# EAGLE design psvemmc-v12 (EAGLE 8.4.3)
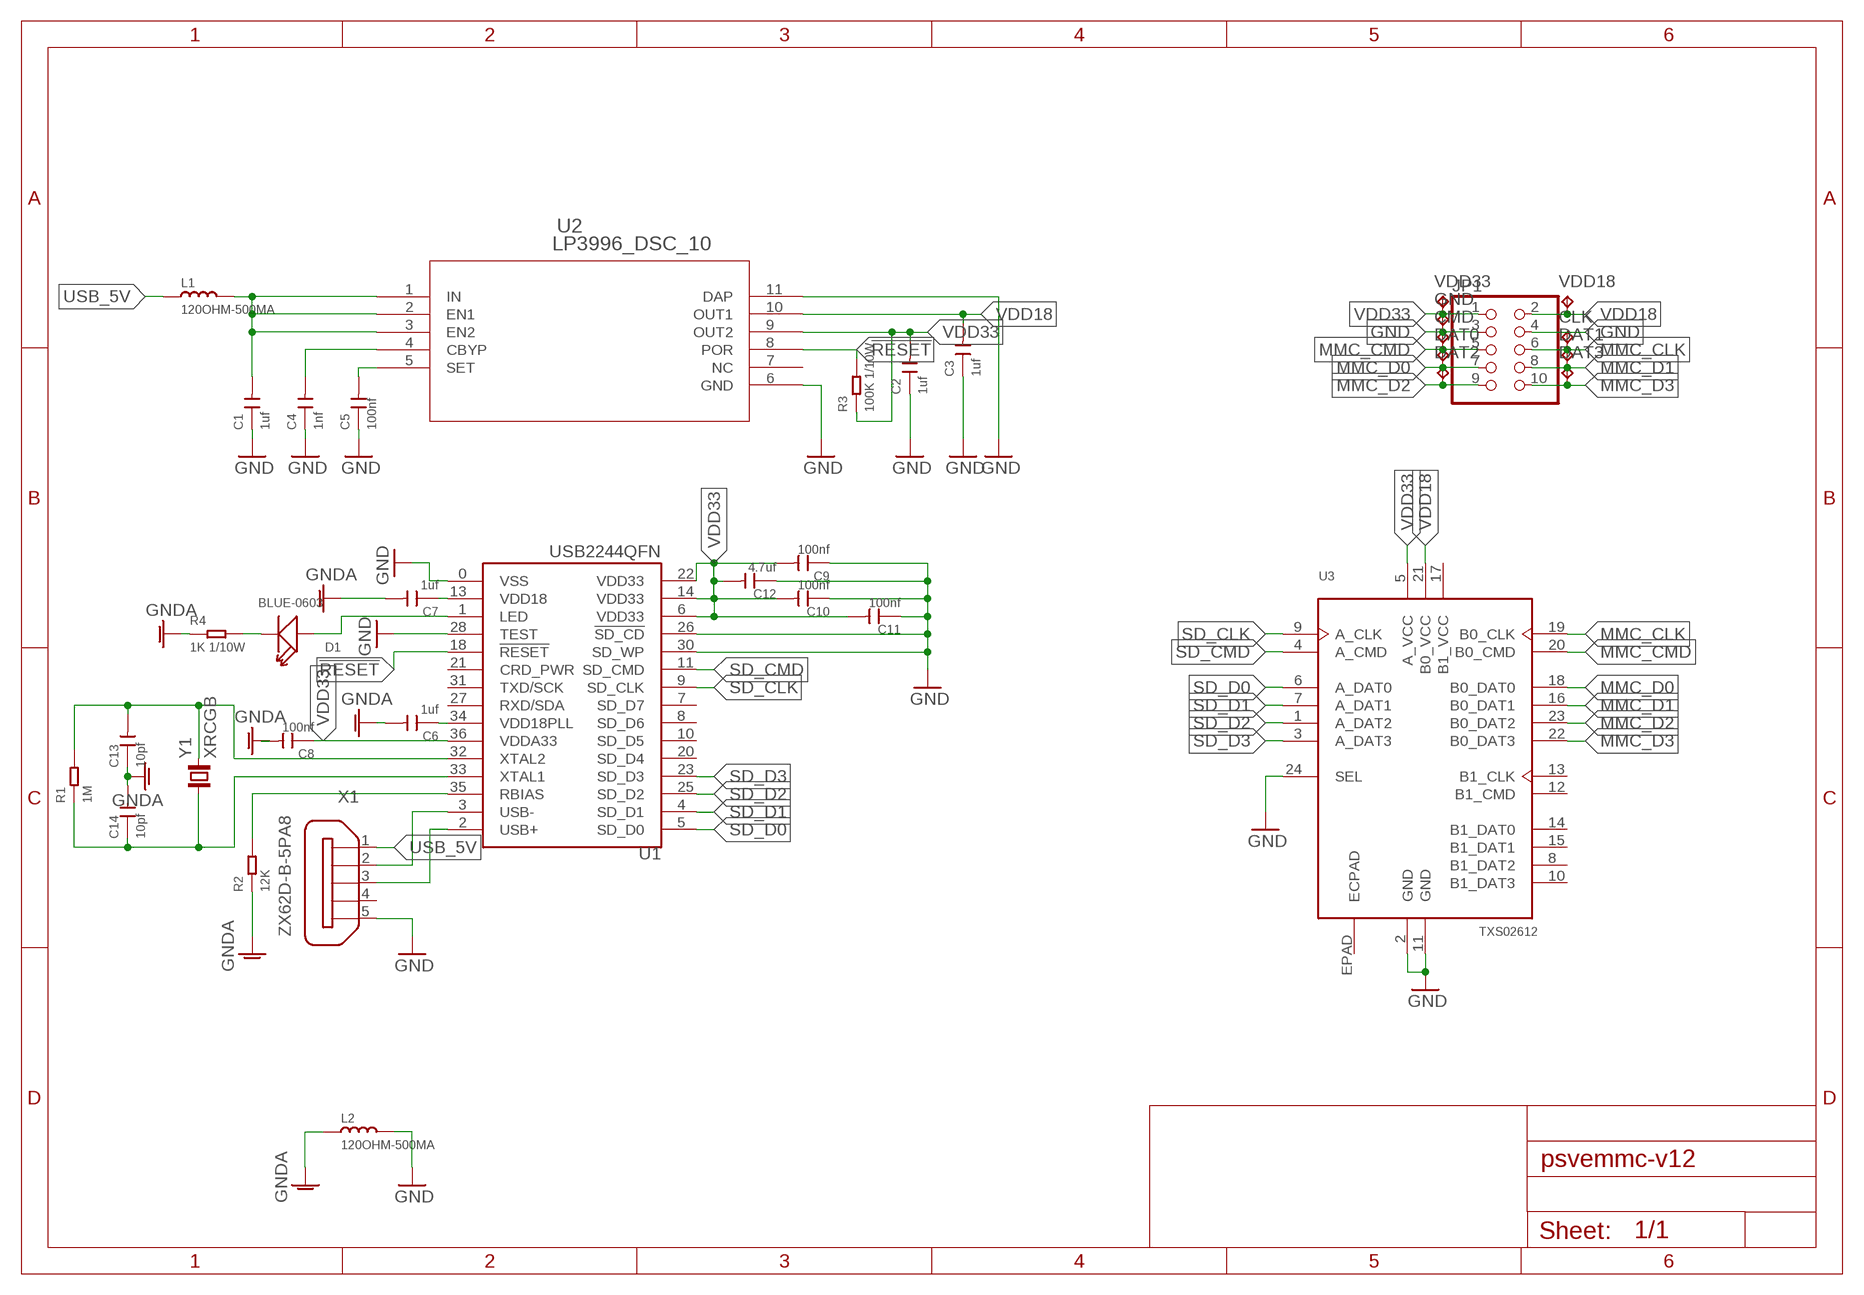
[diagram p0: schematic, sheet 1]

## Parts
C1  1uf  CERAMIC-1UF-25V-10%-X7R(0603)  [C0603]
C2  1uf  CERAMIC-1UF-25V-10%-X7R(0603)  [C0603]
C3  1uf  CERAMIC-1UF-25V-10%-X7R(0603)  [C0603]
C4  1nf  CERAMIC-1NF-50V-5%-C0G(0603)  [C0603]
C5  100nf  CERAMIC-100NF-50V-10%-X7R(0603)  [C0603]
C6  1uf  CERAMIC-1UF-25V-10%-X7R(0603)  [C0603]
C7  1uf  CERAMIC-1UF-25V-10%-X7R(0603)  [C0603]
C8  100nf  CERAMIC-100NF-50V-10%-X7R(0603)  [C0603]
C9  100nf  CERAMIC-100NF-50V-10%-X7R(0603)  [C0603]
C10  100nf  CERAMIC-100NF-50V-10%-X7R(0603)  [C0603]
C11  100nf  CERAMIC-100NF-50V-10%-X7R(0603)  [C0603]
C12  4.7uf  CERAMIC-4.7UF-10V-10%-X5R(0603)  [C0603]
C13  10pf  CERAMIC-10PF-50V-5%-NPO(0603)  [C0603]
C14  10pf  CERAMIC-10PF-50V-5%-NPO(0603)  [C0603]
CLK  TPTP20SQ  [TP20SQ]
CMD  TPTP20SQ  [TP20SQ]
D1  BLUE-0603  SMD-LED-CLEAR-BLUE(0603)  [LED-0603]
DAT0  TPTP20SQ  [TP20SQ]
DAT1  TPTP20SQ  [TP20SQ]
DAT2  TPTP20SQ  [TP20SQ]
DAT3  TPTP20SQ  [TP20SQ]
GND  TPTP20SQ  [TP20SQ]
JP1  PINHD-2X5  [2X05]
L1  120OHM-500MA  SMD-FERRITE-CHIP-120-OHM-500MA(0603)  [L0603]
L2  120OHM-500MA  SMD-FERRITE-CHIP-120-OHM-500MA(0603)  [L0603]
R1  1M  SMD-RES-1M-1%-1/10W(0603)  [R0603]
R2  12K  SMD-RES-12K-1%-1/10W(0603)  [R0603]
R3  100K 1/10W  SMD-RES-100K-5%-1/10W(0603)  [R0603]
R4  1K 1/10W  SMD-RES-1K-5%-1/10W(0603)  [R0603]
U1  USB2244QFN  [QFN36]
U2  LP3996_DSC_10  [SDA10A]
U3  TXS02612  [S-PWQFN-N24]
VDD18  TPTP20SQ  [TP20SQ]
VDD33  TPTP20SQ  [TP20SQ]
X1  ZX62D-B-5PA8  [ZX62D-B-5PA8]
Y1  XRCGB  [XRCGB]

## Nets
!RESET: R3.2 U1.18(!RESET) U2.8(POR)
GND [GND]: C1.1 C2.1 C3.1 C4.1 C5.1 C9.1 C10.1 C11.1 C12.1 GND.TP JP1.3 JP1.4 L2.2 U1.0(VSS) U1.26(!SD_CD) U1.28(TEST) U1.30(SD_WP) U2.6(GND) U2.11(DAP) U3.2(GND) U3.11(GND) U3.24(SEL) X1.5
GNDA: C6.2 C7.2 C8.2 C13.1 C14.2 L2.1 R2.1 R4.1
LED: D1.+ U1.1(LED)
LED_M: D1.- R4.2
MMC_CLK: CLK.TP JP1.6 U3.19(B0_CLK)
MMC_CMD: CMD.TP JP1.5 U3.20(B0_CMD)
MMC_D0: DAT0.TP JP1.7 U3.18(B0_DAT0)
MMC_D1: DAT1.TP JP1.8 U3.16(B0_DAT1)
MMC_D2: DAT2.TP JP1.9 U3.23(B0_DAT2)
MMC_D3: DAT3.TP JP1.10 U3.22(B0_DAT3)
N$2: C4.2 U2.4(CBYP)
RBIAS: R2.2 U1.35(RBIAS)
SD_CLK: U1.9(SD_CLK) U3.9(A_CLK)
SD_CMD: U1.11(SD_CMD) U3.4(A_CMD)
SD_D0: U1.5(SD_D0) U3.6(A_DAT0)
SD_D1: U1.4(SD_D1) U3.7(A_DAT1)
SD_D2: U1.25(SD_D2) U3.1(A_DAT2)
SD_D3: U1.23(SD_D3) U3.3(A_DAT3)
SET: C5.2 U2.5(SET)
USB_5V: L1.1 X1.1
USB_M [USB]: U1.3(USB-) X1.2
USB_P [USB]: U1.2(USB+) X1.3
VDD5: C1.2 L1.2 U2.1(IN) U2.2(EN1) U2.3(EN2)
VDD18: C3.2 JP1.2 U2.10(OUT1) U3.21(B0_VCC) VDD18.TP
VDD18_PLL: C6.1 U1.34(VDD18PLL)
VDD18_USB: C7.1 U1.13(VDD18)
VDD33: C2.2 C8.1 C9.2 C10.2 C11.2 C12.2 JP1.1 R3.1 U1.6(VDD33) U1.14(VDD33) U1.22(VDD33) U1.36(VDDA33) U2.9(OUT2) U3.5(A_VCC) VDD33.TP
XTAL1: C14.1 R1.1 U1.33(XTAL1) Y1.1
XTAL2: C13.2 R1.2 U1.32(XTAL2) Y1.3
Unconnected: U1.7(SD_D7) U1.8(SD_D6) U1.10(SD_D5) U1.20(SD_D4) U1.21(CRD_PWR) U1.27(RXD/SDA) U1.31(TXD/SCK) U2.7(NC) U3.8(B1_DAT2) U3.10(B1_DAT3) U3.12(B1_CMD) U3.13(B1_CLK) U3.14(B1_DAT0) U3.15(B1_DAT1) X1.4 X1.S1 X1.S2 X1.S3 X1.S4

## Power pins joined to a net without a drawn wire
B1_VCC: U3.17(B1_VCC)
ECPAD: U3.EPAD(ECPAD)

## Library data of the parts
C1-C3 C6 C7 = Seeed-Capacitor:CERAMIC-1UF-25V-10%-X7R(0603): 302010139; MPN: CC0603KRX7R8BB105
C4 = Seeed-Capacitor:CERAMIC-1NF-50V-5%-C0G(0603): 302010341; MPN: GRM1885C1H102JA01D
C5 C8-C11 = Seeed-Capacitor:CERAMIC-100NF-50V-10%-X7R(0603): 302010138; MPN: CC0603KRX7R9BB104
C12 = Seeed-Capacitor:CERAMIC-4.7UF-10V-10%-X5R(0603): 302010111; MPN: CC0603KRX5R6BB475
C13 C14 = Seeed-Capacitor:CERAMIC-10PF-50V-5%-NPO(0603): 302010097; MPN: CC0603JRNPO9BN100
CLK CMD DAT0 DAT1-DAT3 GND VDD18 VDD33 = testpad:TP: Test pad
D1 = Seeed-LED:SMD-LED-CLEAR-BLUE(0603): 304090045; MPN: 19-217-BHC-ZL1M2RY-3T
JP1 = pinhead:PINHD-2X5: PIN HEADER
L1 L2 = Seeed-Inductor:SMD-FERRITE-CHIP-120-OHM-500MA(0603): 303030001; MPN: BLM18AG121SN1D
R1 = Seeed-Resistor:SMD-RES-1M-1%-1/10W(0603): 301010151; MPN: RC0603FR-071ML
R2 = Seeed-Resistor:SMD-RES-12K-1%-1/10W(0603): 301010102; MPN: RC0603FR-0712KL
R3 = Seeed-Resistor:SMD-RES-100K-5%-1/10W(0603): 301010089; MPN: RC0603JR-07100KL
R4 = Seeed-Resistor:SMD-RES-1K-5%-1/10W(0603): 301010291; MPN: RC0603JR-071KL
U1 = USB2244:USB2244: USB2244/USB2244I
U2 = LP3996:LP3996_DSC_10; BASE_PN: LP3996; COMP: TypeLDO; LIBRARY: ReferenceLP3996SD; PARTNUMBER: LP3996SD0833; PIN: Count10; SYMBOL: NameLP3996SD0833; TYPE: LP3996SD0833; VENDOR: NationalSemiconductor; VERSION: 1
U3 = TXS02612:TXS02612
X1 = zx62d-b-5pa8-oshpark_10:ZX62D-B-5PA8: Micro USB Type B Connector - Standard, Shell Through Hole Source: http://www.hirose.co.jp/cataloge_hp/ed_ZX_20140804.pdf; MF: Hirose; MPN: ZX62D-B-5PA8; OC_FARNELL: 2300438; OC_NEWARK: 69W0712
Y1 = crystal:XRCGB: CRYSTAL

## Net classes
1 USB: clearance 0.508 mm to class 0
2 GND: clearance 0.508 mm to class 1

## Board
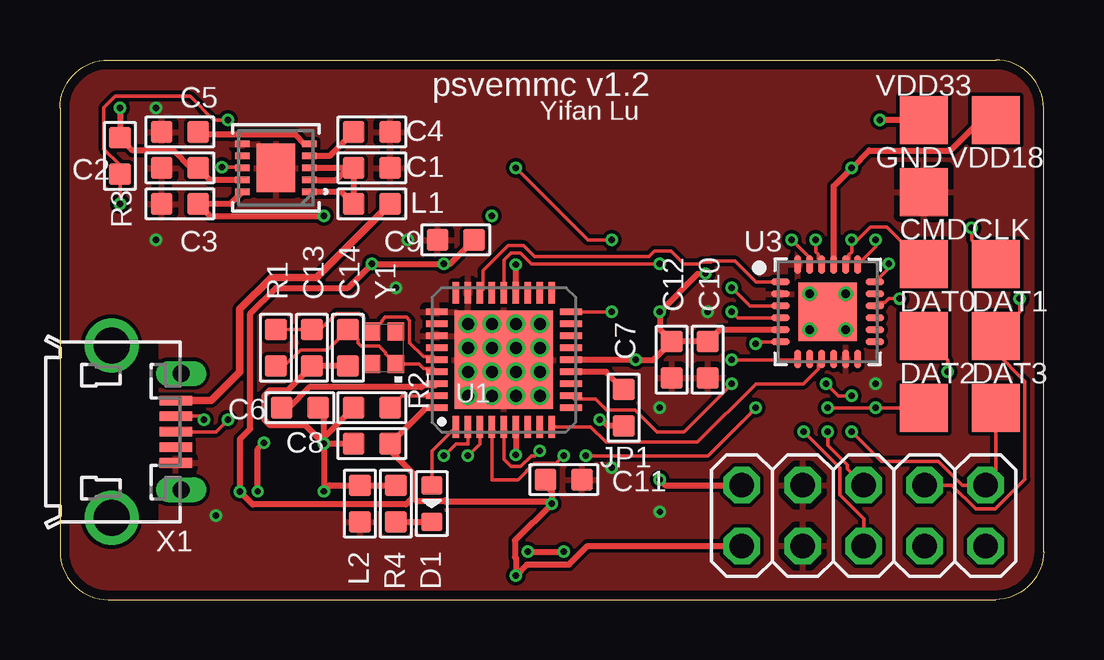
[diagram p1: board, top side]
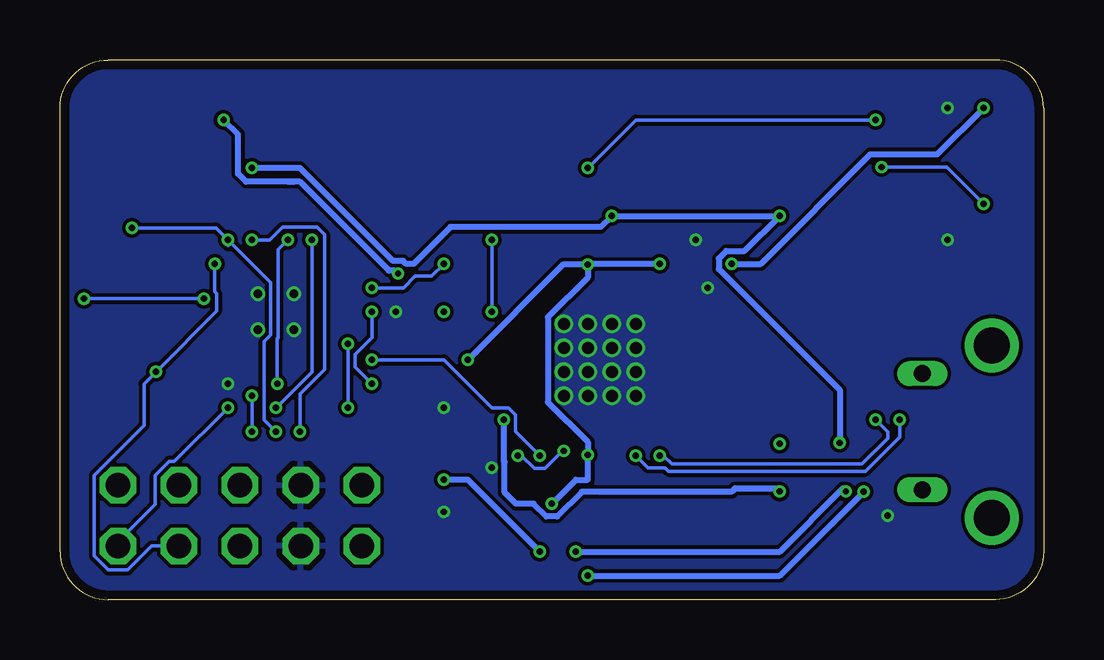
[diagram p2: board, bottom side, seen from below]

Size 41 x 22.5 mm. Coordinates in mm from the lower left corner, seen from the top.
Outline: 2,0 39,0 arc90 41,2 41,20.5 arc90 39,22.5 2,22.5 arc90 0,20.5 0,2 arc90 2,0
Copper layers (1*16): Top 0.035559375mm / dielectric 1.6mm / Bottom 0.035559375mm
Design rules "oshpark-2layer *": minimum track width 6mil, minimum drill 10mil, track to track 6mil, track to pad 6mil, pad to pad 6mil, via to via 6mil, smd to smd 6mil, copper to edge 15mil, drill to drill 6mil, minimum pad ring 5mil, minimum via ring 5mil, stop-mask expansion 2.5mil, vias tented up to drill 0mil, thermal gap 10mil
tKeepout: area 25,15 to 28,22

### Footprints (pad centres in the part's own frame; a part is rotated, then mirrored left to right if it is on the bottom)
C0603 = smd 0.889 x 0.889: 1 0,0.762; 2 0,-0.762
TP20SQ = smd 2 x 2: TP 0,0
LED-0603 = smd 0.762 x 0.889: + -0.762,0; - 0.762,0
2X05 = drill 1.016 octagon: 1 -5.08,-1.27; 2 -5.08,1.27; 3 -2.54,-1.27; 4 -2.54,1.27; 5 0,-1.27; 6 0,1.27; 7 2.54,-1.27; 8 2.54,1.27; 9 5.08,-1.27; 10 5.08,1.27
L0603 = smd 0.889 x 0.889: 1 -0.762,0; 2 0.762,0
R0603 = smd 0.889 x 0.889: 1 0,0.762; 2 0,-0.762
QFN36 = smd 4.1 x 4.1: 0 0,0 | smd 0.28 x 0.9: 1 -2,-2.8; 2 -1.5,-2.8; 3 -1,-2.8; 4 -0.5,-2.8; 5 0,-2.8; 6 0.5,-2.8; 7 1,-2.8; 8 1.5,-2.8; 9 2,-2.8; 19 2,2.8; 20 1.5,2.8; 21 1,2.8; 22 0.5,2.8; 23 0,2.8; 24 -0.5,2.8; 25 -1,2.8; 26 -1.5,2.8; 27 -2,2.8 | smd 0.9 x 0.28: 10 2.8,-2; 11 2.8,-1.5; 12 2.8,-1; 13 2.8,-0.5; 14 2.8,0; 15 2.8,0.5; 16 2.8,1; 17 2.8,1.5; 18 2.8,2; 28 -2.8,2; 29 -2.8,1.5; 30 -2.8,1; 31 -2.8,0.5; 32 -2.8,0; 33 -2.8,-0.5; 34 -2.8,-1; 35 -2.8,-1.5; 36 -2.8,-2
SDA10A = smd 0.61 x 0.254: 1 -1.397,1; 2 -1.397,0.5; 3 -1.397,0; 4 -1.397,-0.5; 5 -1.397,-1; 6 1.397,-1; 7 1.397,-0.5; 8 1.397,0; 9 1.397,0.5; 10 1.397,1 | smd 1.6 x 2.007: 11 0,0
S-PWQFN-N24 = smd 0.78 x 0.28: 1 -1.975,1.25; 2 -1.975,0.75; 3 -1.975,0.25; 4 -1.975,-0.25; 5 -1.975,-0.75; 6 -1.975,-1.25; 13 1.975,-1.25; 14 1.975,-0.75; 15 1.975,-0.25; 16 1.975,0.25; 17 1.975,0.75; 18 1.975,1.25 | smd 0.28 x 0.78: 7 -1.25,-1.975; 8 -0.75,-1.975; 9 -0.25,-1.975; 10 0.25,-1.975; 11 0.75,-1.975; 12 1.25,-1.975; 19 1.25,1.975; 20 0.75,1.975; 21 0.25,1.975; 22 -0.25,1.975; 23 -0.75,1.975; 24 -1.25,1.975 | smd 2.45 x 2.45: EPAD 0,0
ZX62D-B-5PA8 = smd 1.35 x 0.4: 1 4.825,1.3; 2 4.825,0.65; 3 4.825,0; 4 4.825,-0.65; 5 4.825,-1.3 | drill 1.5: S1 2.15,-3.6; S2 2.15,3.6 | drill 0.7 long: S3 5.05,2.425; S4 5.05,-2.425
XRCGB = smd 0.75 x 0.7: 1 -0.675,-0.5; 2 0.675,-0.5; 3 0.675,0.5; 4 -0.675,0.5

### Placement (x,y rotation side)
C1  13,18 270 top
C2  5,18 90 top
C3  5,16.5 90 top
C4  13,19.5 270 top
C5  5,19.5 90 top
C6  10,8 90 top
C7  23.5,8 0 top
C8  13,6.5 270 top
C9  16.5,15 90 top
C10  27,10 180 top
C11  21,5 270 top
C12  25.5,10 180 top
C13  10.5,10.5 180 top
C14  12,10.5 0 top
CLK  39,14 0 top
CMD  36,14 0 top
D1  15.5,4 270 top
DAT0  36,11 0 top
DAT1  39,11 0 top
DAT2  36,8 0 top
DAT3  39,8 0 top
GND  36,17 0 top
JP1  33.5,3.5 0 top
L1  13,16.5 180 top
L2  12.5,4 270 top
R1  9,10.5 180 top
R2  13,8 90 top
R3  2.5,18.5 0 top
R4  14,4 0 top
U1  18.5,10 0 top
U2  9,18 180 top
U3  32,12 0 top
VDD18  39,20 0 top
VDD33  36,20 0 top
X1  0,7 0 top
Y1  13.5,10.5 90 top

### Tracks (layer width: path | path; a pad name or v marks a point on that pad's centre or on a via)
!RESET  (via drill 0.25)
  Top 0.152: U2.8 7.57,18.03 v6.75,18.03 | R3.2 v2.5,16.5 2.5,18.11 1.83,18.79 1.83,20.51 2.3,20.98 5.43,20.98 6.41,20 v7,20 | U1.18 v23,12 | v23,15 22,15 v19,18
  Bottom 0.152: v6.75,18.03 4.03,18.03 v2.5,16.5 | v19,18 17,20 v7,20 | v23,15 v23,12
GND  (via drill 0.25, 0.35, 0.5)
  Top 0.254: U1.0 v19,9.5 | v32.75,12.75 v31.25,12.75 | v31.25,11.25 v32.75,11.25
  other vias: 17,11.5 18,11.5 19,11.5 20,11.5 20,10.5 19,10.5 18,10.5 17,10.5 17,9.5 18,9.5 20,9.5 20,8.5 19,8.5 18,8.5 17,8.5 14,13 4,20.5 14.5,15 23,5.5 6.5,3.5 4,15 25,3.66 25,8 34,9 27,12
  pour Top (rank 5): 0,22.5 0,0 41,0 41,22.5
  pour Bottom: 0,22.5 0,0 41,0 41,22.5
GNDA  (via drill 0.25)
  Top 0.254: C6.2 11,7.76 v11,6.5 | R2.1 11,6.76 v11,6.5 | C8.2 v11,6.5 | 13.74,4.5 R4.1 L2.1 11.25,4.76 v11,4.51 v11,6.5 | C7.2 22.86,7.24 22.72,7.37 22.63,7.37 v22.5,7.5 | C14.2 C13.1 9.49,8.72 8.74,8.72 8.51,8.49 8.51,7.5 8.74,7.28 10.22,7.28 v11,6.5
  Bottom 0.254: v11,4.51 11,4.64 12.86,4.64 13,4.5 19.25,4.5 20.28,3.47 20.72,3.47 21.25,4 22,4 22.47,4.47 22.47,5.72 22.5,5.75 v22.5,7.5
  pour Bottom (rank 3): 8.5,12 15.5,12 15.5,7 18.5,7 18.5,4 8.5,4
LED
  Top 0.152: U1.1 15.5,6.2 D1.+
LED_M
  Top 0.254: R4.2 D1.-
MMC_CLK  (via drill 0.25)
  Top 0.152: 38.32,14 CLK.TP 38,15 v38,15.5 | JP1.6 32.81,5.46 32.81,5.62 32,6.43 v32,7 | v34,15 34,14.72 U3.19
  Bottom 0.152: v34,15 34,14.76 | v38,15.5 34.5,15.5 v34,15 | v34,15 32.22,13.22 32.22,11.03 32.48,10.77 32.48,7.48 v32,7
MMC_CMD  (via drill 0.25)
  Top 0.152: JP1.5 33.5,3.37 32.51,4.36 32.51,5.49 v31,7 | U3.20 32.88,14.11 32.88,14.38 33,14.5 v33,15 33.25,15 33.78,15.53 34.47,15.53 CMD.TP
  Bottom 0.152: v31,7 31,8.57 29.97,9.6 29.97,15.22 30.28,15.53 31.72,15.53 32.25,15 v33,15
MMC_D0  (via drill 0.25)
  Top 0.152: 36,11.5 DAT0.TP 37,10 v37,9.5 | U3.18 34.55,13.82 v34.55,14
  Bottom 0.152: JP1.7 37.18,2.23 38.17,1.24 38.99,1.24 39.57,1.82 39.57,5.18 37.5,7.25 37.5,9 v37,9.5 34.47,12.03 34.47,12.77 34.55,12.84 v34.55,14
MMC_D1  (via drill 0.25)
  Top 0.152: DAT1.TP 38.32,11 | JP1.8 37.18,4.77 38.17,3.78 38.99,3.78 40.23,5.02 40.23,9.1 39,10.32 DAT1.TP | v40,12.55 40,12 DAT1.TP | v35,12.55 34.54,12.55 34.38,12.38 34.11,12.38 U3.16
  Bottom 0.152: v40,12.55 v35,12.55
MMC_D2  (via drill 0.25)
  Top 0.152: v32,8 v34,8 DAT2.TP | v30.5,15 31.25,14.25 U3.23
  Bottom 0.152: JP1.9 38.58,2.42 37.03,3.97 37.03,5.18 36.45,5.76 36.24,5.76 v34,8 | v32,8 30.5,9.5 v30.5,15
MMC_D3  (via drill 0.25)
  Top 0.152: DAT3.TP 39,5.19 JP1.10 37.61,4.77 36.62,5.76 34.24,5.76 v33,7 | v31.5,15 31.5,14.5 31.62,14.38 31.62,14.11 U3.22 | v31.94,9 32.44,8.5 v33,8.5
  Bottom 0.152: v31.94,9 31.94,10.88 31.91,10.9 31.91,14.59 v31.5,15 | v33,8.5 v33,7
N$2
  Top 0.254: C4.2 11.24,18.5 U2.4
RBIAS
  Top 0.152: R2.2 14.26,8.5 U1.35
SD_CLK
  Top 0.152: U1.9 22.12,7.2 22.75,6.57 26.57,6.57 29,9 31,9 31.62,9.62 31.62,9.89 U3.9
SD_CMD  (via drill 0.25)
  Top 0.152: U3.4 28.25,11.75 v28,12 | v28,9 26,7 24.89,7 23.97,7.91 22.77,7.91 22.31,8.37 21.43,8.37 U1.11
  Bottom 0.152: v28,12 28,10.92 28.7,10.22 28.7,9.7 v28,9
SD_D0  (via drill 0.25)
  Top 0.152: U1.5 18.52,7.18 18.52,5.83 | v29,10.67 29.08,10.75 U3.6 | 18.52,6 18.52,5.83 | 18.52,5.83 18.8,5.55 19.2,5.55 19.65,6 19.8,6 v20,6.2 | v21.92,6 27,6 v29,8
  Bottom 0.152: v29,8 v29,10.67 | v20,6.2 20.05,6.2 20.78,5.47 21.22,5.47 21.75,6 v21.92,6
SD_D1  (via drill 0.25)
  Top 0.152: U3.7 30.73,10 v28,10 | v21,6 20.67,5.67 19.76,5.67 19.09,5 18,5 U1.4
  Bottom 0.152: v28,10 25,10 22.98,7.98 22.3,7.98 22.02,7.7 22.02,7.02 v21,6
SD_D2
  Top 0.152: U3.1 29,13.25 28.13,14.12 27.19,14.12 27.14,14.07 26.71,14.07 26.64,14 26,14 25.47,14.53 24.78,14.53 24.55,14.3 19.77,14.3 19.33,14.75 18.67,14.75 17.63,13.71 17.63,12.93 U1.25
SD_D3  (via drill 0.25)
  Top 0.152: v25,14 19.65,14 19.2,14.45 18.8,14.45 18.52,14.16 18.52,12.82 U1.23 | U3.3 28.75,12.25 v28,13
  Bottom 0.152: v28,13 26.68,13 26.2,13.48 25.52,13.48 v25,14
SET
  Top 0.254: U2.5 10.2,19 9.79,19.41 5.86,19.41 C5.2
USB_5V
  Top 0.305: X1.1 6.3,8.3 7.5,9.49 7.5,12.11 8.82,13.43 10.69,13.43 11.63,14.37 | 11.63,14.37 11.26,14 | 11.63,14.37 L1.1
USB_M  (via drill 0.25)
  Top 0.152: v17,6 17.5,6.5 U1.3 | X1.2 5.85,7.65 v6,7.5
  Bottom 0.152: v17,6 16.5,5.5 15.78,5.5 15.63,5.35 7.44,5.35 | 7.44,5.35 | v6,7.5 6,6.78 7.44,5.35
USB_P  (via drill 0.25)
  Top 0.152: v16,6 16.5,6.5 17,6.5 U1.2 | X1.3 6.5,7 v7,7.5
  Bottom 0.152: v16,6 15.85,6 15.5,5.65 7.56,5.65 6.5,6.72 6.5,7 v7,7.5
VDD5
  Top 0.254: U2.1 11.74,17 L1.2 C1.2 12,18 | 12,18 U2.3 | U2.2 11.5,17.5 12,18
VDD18  (via drill 0.25)
  Top 0.254: U2.10 7.1,16.5 C3.2 6.26,16 v11,16 | v19.5,2 v21,2 | v8.24,4.51 8.24,6.28 v8.5,6.54 | U3.21 32.25,17.25 v33,18 33.72,18.72 37.12,18.72 38.4,20 VDD18.TP | v25,5 25.23,4.77 JP1.2
  Bottom 0.254: v21,2 24,5 v25,5 | v8.24,4.51 v8.24,4.52 8.36,4.64 11,2 v19.5,2 | 8.5,6.5 v8.5,6.54 8.5,8.75 13.53,13.78 13.53,14.22 13.22,14.53 12.47,14.53 v11,16 v18,16 18.47,15.53 24.72,15.53 26.25,14 26.57,14 26.69,14.12 27.12,14.12 31,18 v33,18
VDD18_PLL
  Top 0.254: 9.54,8 C6.1 9.54,8 | U1.34 15.62,8.92 15.13,8.92 15.07,8.86 10.4,8.86 9.54,8
VDD18_USB
  Top 0.254: C7.1 22.76,9.5 U1.13
VDD33  (via drill 0.25)
  Top 0.254: U2.9 6.26,17.5 C2.2 5.46,18 4.73,18.72 3.04,18.72 R3.1 v2.5,20.5 | U1.36 15.26,8 C8.1 13.76,6.22 14.72,5.26 14.72,4.27 | C12.2 24.74,10 v24,10 U1.14 | C12.2 C10.2 27.49,11.25 U3.5 | U1.6 v19,6.04 | 20.12,4.88 20,4.76 | 20.12,4.88 C11.2 | U1.22 v19,13.96 | 14.72,4.27 14.42,3.97 8.03,3.97 v7.5,4.5 7.5,6.69 7.93,7.12 7.93,11.93 9,13 12,13 v13,14 v16,14 16.26,14 C9.2 | 16.05,4.15 16,4.1 | 16,4.1 14.89,4.1 14.72,4.27 | v20.5,4 20.5,4.5 20.12,4.88 | VDD33.TP v34.18,20 | v26.91,13.59 26.59,13.59 v25,12 25,11.26 C12.2 | v20.5,4 18.97,2.47 18.97,1.78 19,1.75 v19,1 19.47,1.47 21.22,1.47 21.98,2.23 JP1.1 | 16,4.1 20.4,4.1 v20.5,4
  Bottom 0.254: v7.5,4.5 11,1 v19,1 | v2.5,20.5 4.43,18.57 7.22,18.57 11.79,14 v13,14 | v19,13.96 20.04,13.96 v24,10 | v19,13.96 19,13.43 20.66,11.77 20.66,8.23 19,6.57 v19,6.04 19,5 19.5,5 v20.5,4 | v16,14 18.96,14 v19,13.96 | 31.5,17.42 31.24,17.42 | 31.5,17.42 33.24,17.42 33.58,17.76 33.58,19.4 v34.18,20 | v26.91,13.59 27.04,13.72 27.29,13.72 30.99,17.42 31.5,17.42
XTAL1
  Top 0.152: U1.33 15.57,9.63 15.15,9.63 14.96,9.82 Y1.1 13.58,10.25 13.58,10.29 13.3,10.57 12.55,10.57 12.42,10.71 12.42,10.84 C14.1 11.15,10.41 10.03,10.41 9.35,9.74 R1.1
XTAL2
  Top 0.152: U1.32 15.57,10.13 15.15,10.13 14.58,10.71 14.58,11.64 14.45,11.78 13.55,11.78 13.42,11.64 13.42,11.6 Y1.3 12.67,11.5 12.67,11.74 12.47,11.94 11.53,11.94 10.85,11.26 C13.2 R1.2

### Text on the board
tPlace: psvemmc v1.2 | Yifan Lu